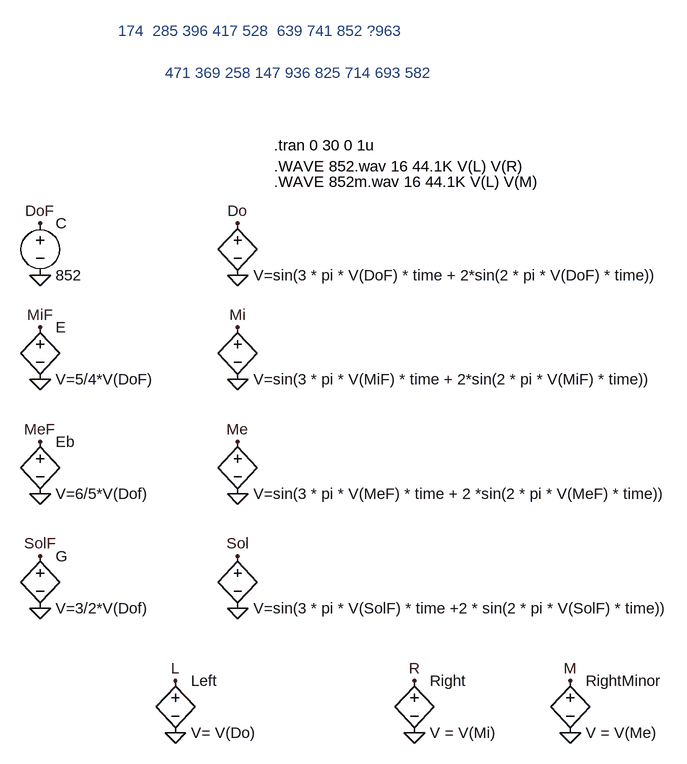
[diagram p0: schematic 852.asc]
852.asc, the LTspice schematic file:
Version 4
SHEET 1 1512 900
FLAG 320 -304 Do
FLAG 320 -224 0
FLAG 320 -144 Mi
FLAG 320 -64 0
FLAG 320 208 Sol
FLAG 320 288 0
FLAG 320 32 Me
FLAG 320 112 0
FLAG 16 288 0
FLAG 16 -64 0
FLAG 16 112 0
FLAG 16 -144 MiF
FLAG 16 32 MeF
FLAG 16 208 SolF
FLAG 16 -224 0
FLAG 16 -304 DoF
FLAG 224 400 L
FLAG 592 400 R
FLAG 832 400 M
FLAG 224 480 0
FLAG 592 480 0
FLAG 832 480 0
SYMBOL bv 320 -320 R0
WINDOW 0 24 16 Invisible 2
SYMATTR InstName B1
SYMATTR Value V=sin(3 * pi * V(DoF) * time + 2*sin(2 * pi * V(DoF) * time))
SYMBOL bv 320 -160 R0
WINDOW 0 24 16 Invisible 2
SYMATTR InstName B2
SYMATTR Value V=sin(3 * pi * V(MiF) * time + 2*sin(2 * pi * V(MiF) * time))
SYMBOL bv 320 192 R0
WINDOW 0 24 16 Invisible 2
SYMATTR InstName B3
SYMATTR Value V=sin(3 * pi * V(SolF) * time +2 * sin(2 * pi * V(SolF) * time))
SYMBOL bv 320 16 R0
WINDOW 0 24 16 Invisible 2
SYMATTR InstName B4
SYMATTR Value V=sin(3 * pi * V(MeF) * time + 2 *sin(2 * pi * V(MeF) * time))
SYMBOL bv 16 -160 R0
SYMATTR InstName E
SYMATTR Value V=5/4*V(DoF)
SYMBOL bv 16 16 R0
SYMATTR InstName Eb
SYMATTR Value V=6/5*V(Dof)
SYMBOL bv 16 192 R0
SYMATTR InstName G
SYMATTR Value V=3/2*V(Dof)
SYMBOL voltage 16 -320 R0
WINDOW 123 0 0 Left 0
WINDOW 39 0 0 Left 0
SYMATTR InstName C
SYMATTR Value 852
SYMBOL bv 224 384 R0
SYMATTR InstName Left
SYMATTR Value V= V(Do)
SYMBOL bv 592 384 R0
SYMATTR InstName Right
SYMATTR Value V = V(Mi)
SYMBOL bv 832 384 R0
SYMATTR InstName RightMinor
SYMATTR Value V = V(Me)
TEXT 376 -424 Left 2 !.tran 0 30 0 1u
TEXT 376 -392 Left 2 !.WAVE 852.wav 16 44.1K V(L) V(R)
TEXT 136 -600 Left 2 ;174  285 396 417 528  639 741 852 ?963
TEXT 208 -536 Left 2 ;471 369 258 147 936 825 714 693 582
TEXT 376 -368 Left 2 !.WAVE 852m.wav 16 44.1K V(L) V(M)

The netlist it stands for:
* 852.asc
B1 Do 0 V=sin(3 * pi * V(DoF) * time + 2*sin(2 * pi * V(DoF) * time))
B2 Mi 0 V=sin(3 * pi * V(MiF) * time + 2*sin(2 * pi * V(MiF) * time))
B3 Sol 0 V=sin(3 * pi * V(SolF) * time +2 * sin(2 * pi * V(SolF) * time))
B4 Me 0 V=sin(3 * pi * V(MeF) * time + 2 *sin(2 * pi * V(MeF) * time))
B§E MiF 0 V=5/4*V(DoF)
B§Eb MeF 0 V=6/5*V(Dof)
B§G SolF 0 V=3/2*V(Dof)
V§C DoF 0 852
B§Left L 0 V= V(Do)
B§Right R 0 V = V(Mi)
B§RightMinor M 0 V = V(Me)
.tran 0 30 0 1u
.WAVE 852.wav 16 44.1K V(L) V(R)
* 174  285 396 417 528  639 741 852 ?963
* 471 369 258 147 936 825 714 693 582
.WAVE 852m.wav 16 44.1K V(L) V(M)
.backanno
.end